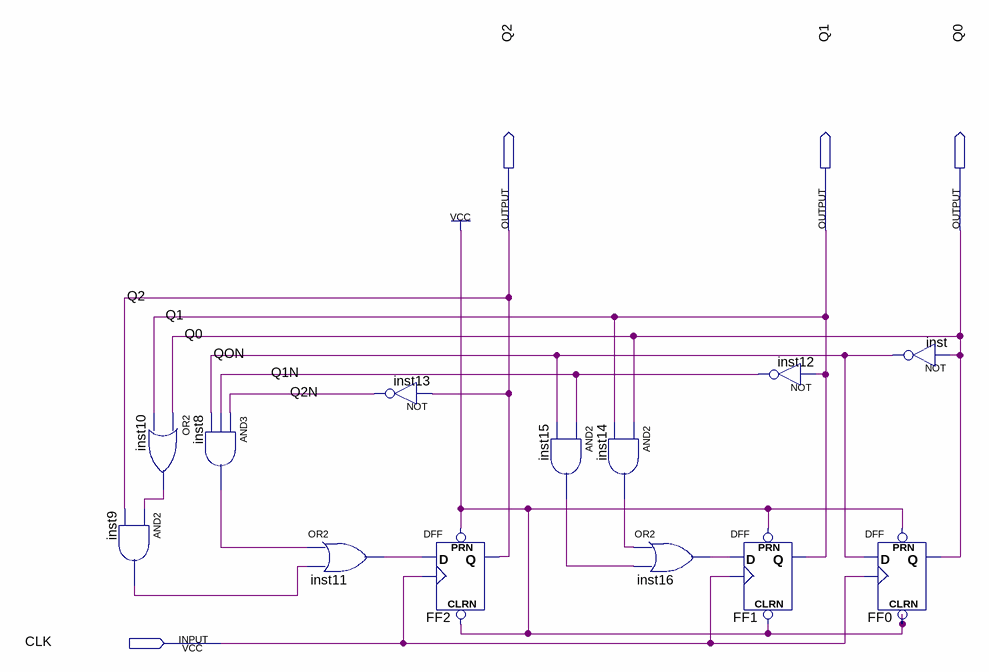
[diagram p0: schematic sheet]
// Quartus schematic HW82.bdf as structural Verilog: 13 symbols, 4 pins
module HW82 (
  input  CLK,
  output Q2,
  output Q1,
  output Q0
);

  wire inst8_out, inst9_out, inst10_out, inst11_out, inst14_out, inst15_out, inst16_out, Q1N, Q2N, QON;

  and inst9 (inst9_out, inst10_out, Q2);
  or inst10 (inst10_out, Q0, Q1);
  and inst8 (inst8_out, Q2N, Q1N, QON);
  or inst11 (inst11_out, inst8_out, inst9_out);
  not inst13 (Q2N, Q2);
  DFF FF2 (.CLRN(1'b1), .CLK(CLK), .D(inst11_out), .PRN(1'b1), .Q(Q2));
  and inst15 (inst15_out, Q1N, QON);
  and inst14 (inst14_out, Q0, Q1);
  or inst16 (inst16_out, inst14_out, inst15_out);
  DFF FF1 (.CLRN(1'b1), .CLK(CLK), .D(inst16_out), .PRN(1'b1), .Q(Q1));
  not inst12 (Q1N, Q1);
  DFF FF0 (.CLRN(1'b1), .CLK(CLK), .D(QON), .PRN(1'b1), .Q(Q0));
  not inst (QON, Q0);
endmodule
